# Altium schematic sheet Gyroscope-Acceleromter.SchDoc
size A
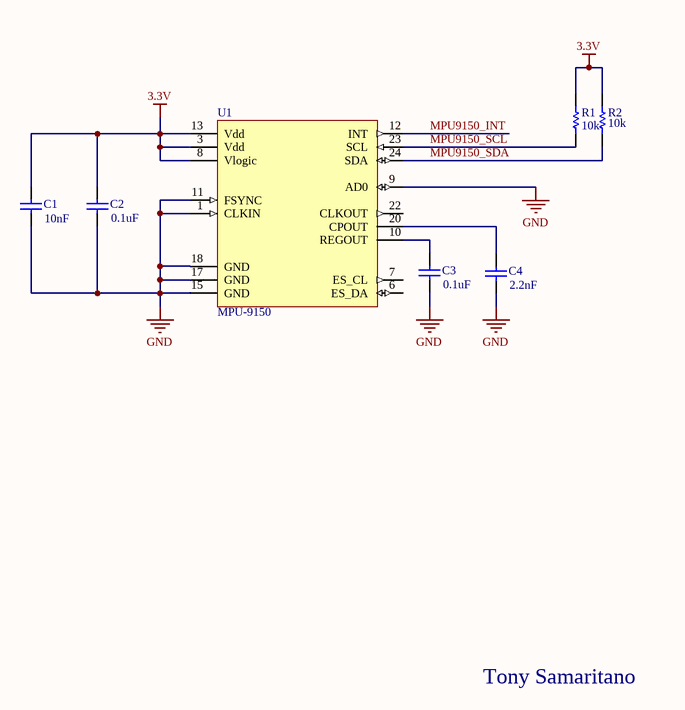
[diagram p0: Gyroscope-Acceleromter.SchDoc]

## Parts
C1  value 10nF  [1608[0603]]  (hidden comment: Cap Semi)
C2  value 0.1uF  [1608[0603]]  (hidden comment: Cap Semi)
C3  value 0.1uF  [1608[0603]]  (hidden comment: Cap Semi)
C4  value 2.2nF  [1608[0603]]  (hidden comment: Cap Semi)
R1  value 10k  [0603]  (hidden comment: Resistor)
R2  value 10k  [0603]  (hidden comment: Resistor)
U1  MPU-9150  [MPU-9150]

## Nets
3.3V: C1.2 C2.2 R1.2 R2.2 U1.3(Vdd) U1.8(Vlogic) U1.13(Vdd)
GND: C1.1 C2.1 C3.1 C4.1 U1.1(CLKIN) U1.9(AD0) U1.11(FSYNC) U1.15(GND) U1.17(GND) U1.18(GND)
MPU9150_INT: U1.12(INT)
MPU9150_SCL: R1.1 U1.23(SCL)
MPU9150_SDA: R2.1 U1.24(SDA)
NetC3_2: C3.2 U1.10(REGOUT)
NetC4_2: C4.2 U1.20(CPOUT)

Not connected (* = marked no-connect by the designer): U1 6(ES_DA) 7(ES_CL) 22(CLKOUT)

## Notes on the sheet
- Tony Samaritano

## Library data of the parts
C1-C4 = Cap Semi: Capacitor (Semiconductor SIM Model); Published: 8-Jun-2000; LatestRevisionDate: 29-May-2009; LatestRevisionNote: IPC-7351 Footprint Added.; PackageReference: C1206; Publisher: Altium Limited; PackageDescription: Chip Capacitor
R1 R2 = Resistor: Published: 8-Jun-2000; LatestRevisionDate: 17-Jul-2002; LatestRevisionNote: Re-released for DXP Platform.; PackageReference: AXIAL-0.3; Publisher: Altium Limited